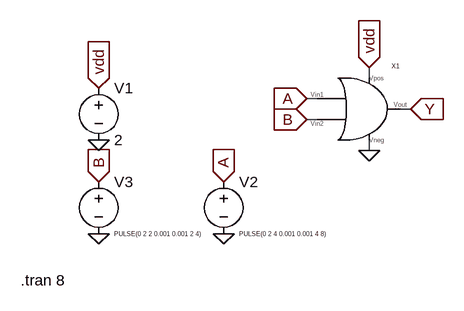
[diagram p0: schematic or symbol.asc]
or symbol.asc, the LTspice schematic file:
Version 4
SHEET 1 880 680
WIRE 288 96 288 80
WIRE 208 128 192 128
WIRE 352 144 336 144
WIRE 208 160 192 160
WIRE 288 208 288 192
FLAG 288 80 vdd
IOPIN 288 80 In
FLAG -128 112 vdd
IOPIN -128 112 In
FLAG 192 128 A
IOPIN 192 128 In
FLAG 64 256 A
IOPIN 64 256 In
FLAG 192 160 B
IOPIN 192 160 In
FLAG -128 256 B
IOPIN -128 256 In
FLAG 352 144 Y
IOPIN 352 144 In
FLAG 288 208 0
FLAG -128 192 0
FLAG 64 336 0
FLAG -128 336 0
SYMBOL or 32 144 R0
SYMATTR InstName X1
SYMBOL voltage -128 96 R0
WINDOW 123 0 0 Left 0
WINDOW 39 0 0 Left 0
SYMATTR InstName V1
SYMATTR Value 2
SYMBOL voltage 64 240 R0
WINDOW 3 24 96 Left 0
WINDOW 123 0 0 Left 0
WINDOW 39 0 0 Left 0
SYMATTR Value PULSE(0 2 4 0.001 0.001 4 8)
SYMATTR InstName V2
SYMBOL voltage -128 240 R0
WINDOW 3 24 96 Left 0
WINDOW 123 0 0 Left 0
WINDOW 39 0 0 Left 0
SYMATTR Value PULSE(0 2 2 0.001 0.001 2 4)
SYMATTR InstName V3
TEXT -248 408 Left 2 !.tran 8

The netlist it stands for:
* or symbol.asc
XX1 vdd A B 0 Y or  ; pins vdd A B gnd Y
V1 vdd 0 2
V2 A 0 PULSE(0 2 4 0.001 0.001 4 8)
V3 B 0 PULSE(0 2 2 0.001 0.001 2 4)
.tran 8
.backanno
.end